# EAGLE design main board (EAGLE 9.6.2)
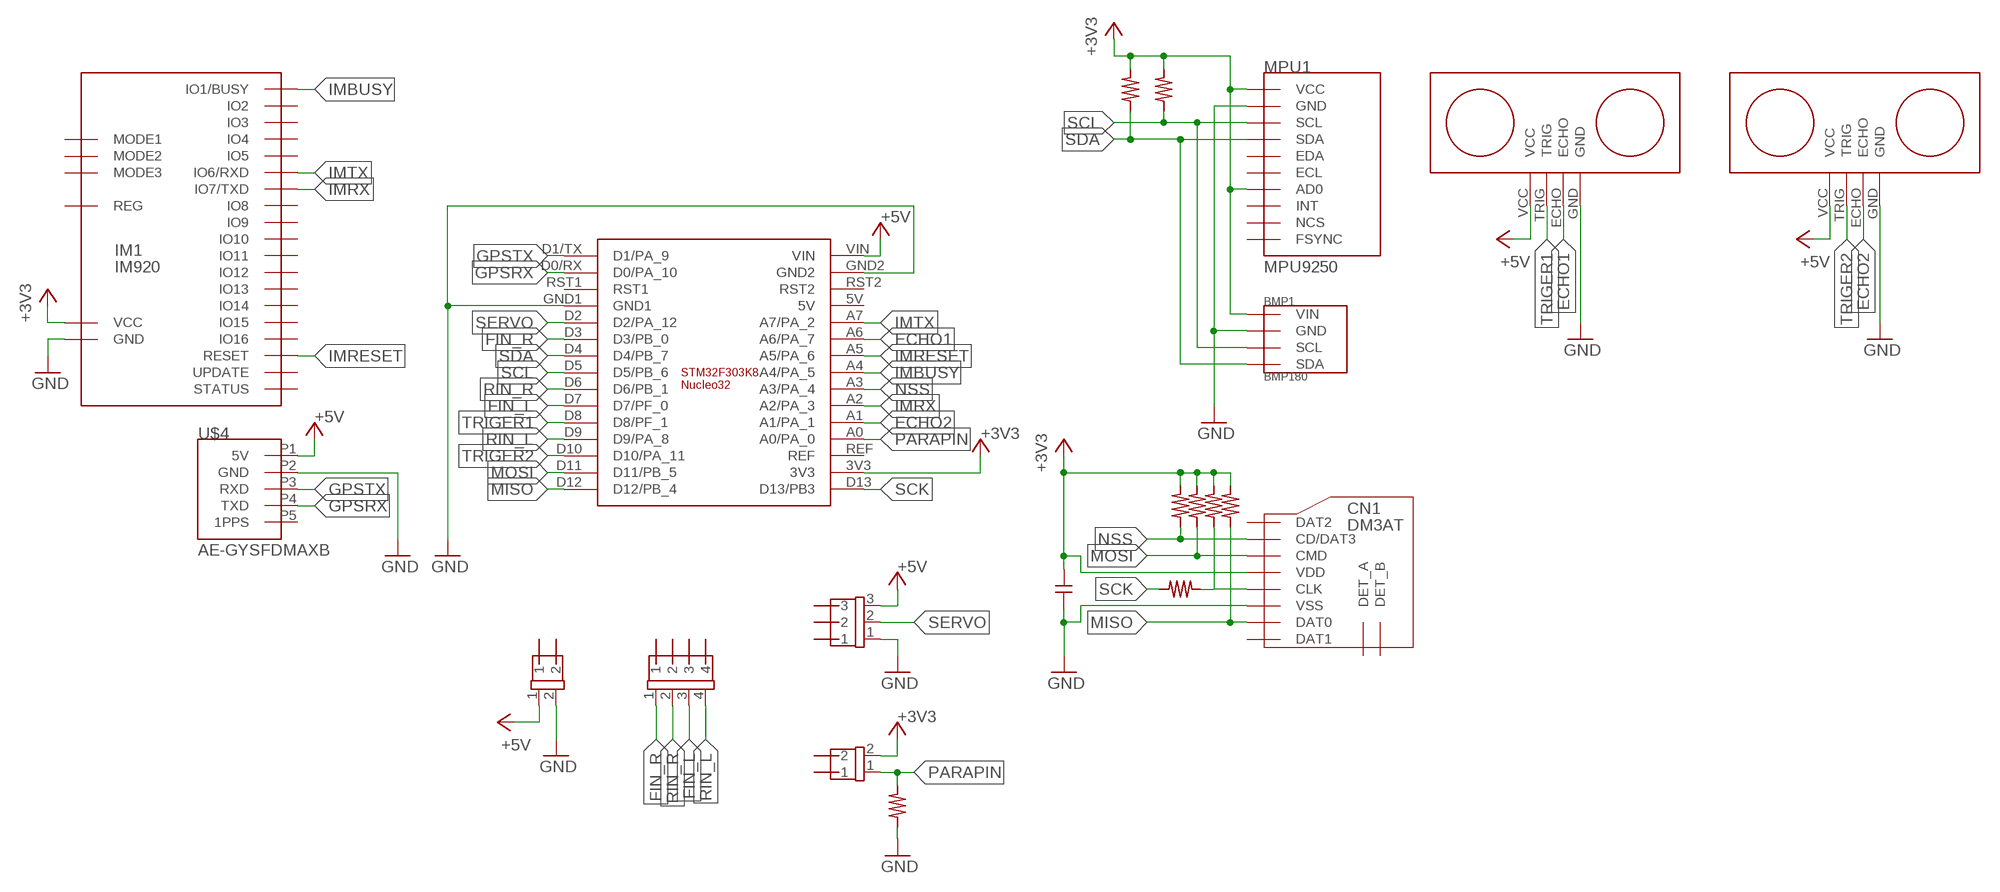
[diagram p0: schematic, sheet 1]

## Parts
BMP1  BMP180  [GY-68]
C4  CAPACITOR-CERAMICC_1  [CAPACITOR-CERAMICC_1]
CN1  DM3AT  [DM3AT]
CONN1  2PIN  [2PIN]
CONN2  2PIN  [2PIN]
CONN3  4PIN  [4PIN]
CONN4  3PIN  [3PIN]
CP1  STM32F303K8-NUCLEO32  [STM32-NUCLEO32]
EC1  ECHO  [ECHO]
EC2  ECHO  [ECHO]
IM1  IM920  [IM920]
MPU1  MPU9250  [GY-9250]
R2  RESISTER  [REGISTER]
R4  RESISTER  [REGISTER]
R5  RESISTER  [REGISTER]
R6  RESISTER  [REGISTER]
R7  RESISTER  [REGISTER]
R8  RESISTER  [REGISTER]
R9  RESISTER  [REGISTER]
R10  RESISTER  [REGISTER]
U$4  AE-GYSFDMAXB  [AE-GYSFDMAXB]

## Nets
+3V3: BMP1.P1(VIN) C4.2 CN1.VDD CONN1.2 CP1.3V3 IM1.IO23(VCC) MPU1.P1(VCC) MPU1.P7(AD0) R4.B R5.B R6.B R7.B R8.B R9.B
+5V: CONN2.1 CONN4.3 CP1.VIN EC1.VCC EC2.VCC U$4.P1(5V)
ECHO1: CP1.A6(A6/PA_7) EC1.ECHO
ECHO2: CP1.A1(A1/PA_1) EC2.ECHO
FIN_L: CONN3.3 CP1.D7(D7/PF_0)
FIN_R: CONN3.1 CP1.D3(D3/PB_0)
GND: BMP1.P2(GND) C4.1 CN1.VSS CONN2.2 CONN4.1 CP1.GND1 CP1.GND2 EC1.GND EC2.GND IM1.IO24(GND) MPU1.P2(GND) R2.A U$4.P2(GND)
GPSRX: CP1.D0/RX(D0/PA_10) U$4.P4(TXD)
GPSTX: CP1.D1/TX(D1/PA_9) U$4.P3(RXD)
IMBUSY: CP1.A4(A4/PA_5) IM1.IO1(IO1/BUSY)
IMRESET: CP1.A5(A5/PA_6) IM1.IO25(RESET)
IMRX: CP1.A2(A2/PA_3) IM1.IO7(IO7/TXD)
IMTX: CP1.A7(A7/PA_2) IM1.IO6(IO6/RXD)
MISO: CN1.DAT0 CP1.D12(D12/PB_4) R6.A
MOSI: CN1.CMD CP1.D11(D11/PB_5) R8.A
N$6: CN1.CLK R7.A R10.B
NSS: CN1.CD/DAT3 CP1.A3(A3/PA_4) R9.A
PARAPIN: CONN1.1 CP1.A0(A0/PA_0) R2.B
RIN_L: CONN3.4 CP1.D9(D9/PA_8)
RIN_R: CONN3.2 CP1.D6(D6/PB_1)
SCK: CP1.D13(D13/PB3) R10.A
SCL: BMP1.P3(SCL) CP1.D5(D5/PB_6) MPU1.P3(SCL) R4.A
SDA: BMP1.P4(SDA) CP1.D4(D4/PB_7) MPU1.P4(SDA) R5.A
SERVO: CONN4.2 CP1.D2(D2/PA_12)
TRIGER1: CP1.D8(D8/PF_1) EC1.TRIG
TRIGER2: CP1.D10(D10/PA_11) EC2.TRIG
Unconnected: CN1.DAT1 CN1.DAT2 CN1.DET_A CN1.DET_B CP1.5V CP1.REF CP1.RST1 CP1.RST2 IM1.IO2 IM1.IO3 IM1.IO4 IM1.IO5 IM1.IO8 IM1.IO9 IM1.IO10 IM1.IO11 IM1.IO12 IM1.IO13 IM1.IO14 IM1.IO15 IM1.IO16 IM1.IO17(MODE1) IM1.IO18(MODE2) IM1.IO19(MODE3) IM1.IO20(UPDATE) IM1.IO21(STATUS) IM1.IO22(REG) MPU1.P5(EDA) MPU1.P6(ECL) MPU1.P8(INT) MPU1.P9(NCS) MPU1.P10(FSYNC) U$4.P5(1PPS)

## Library data of the parts
BMP1 = BMP180:BMP180
C4 = normal capacitor:CAPACITOR-CERAMICC_1
CN1 = microSD:DM3AT
CONN1 CONN2 = 171822 connecter:2PIN
CONN3 = 171822 connecter:4PIN
CONN4 = 171822 connecter:3PIN
CP1 = STM32:STM32F303K8-NUCLEO32
EC1 EC2 = ECHO:ECHO
IM1 = IM920:IM920
MPU1 = MPU9250:MPU9250
R2 R4-R10 = normal register:RESISTER
U$4 = AE-GYSFDMAXB:AE-GYSFDMAXB

## Board
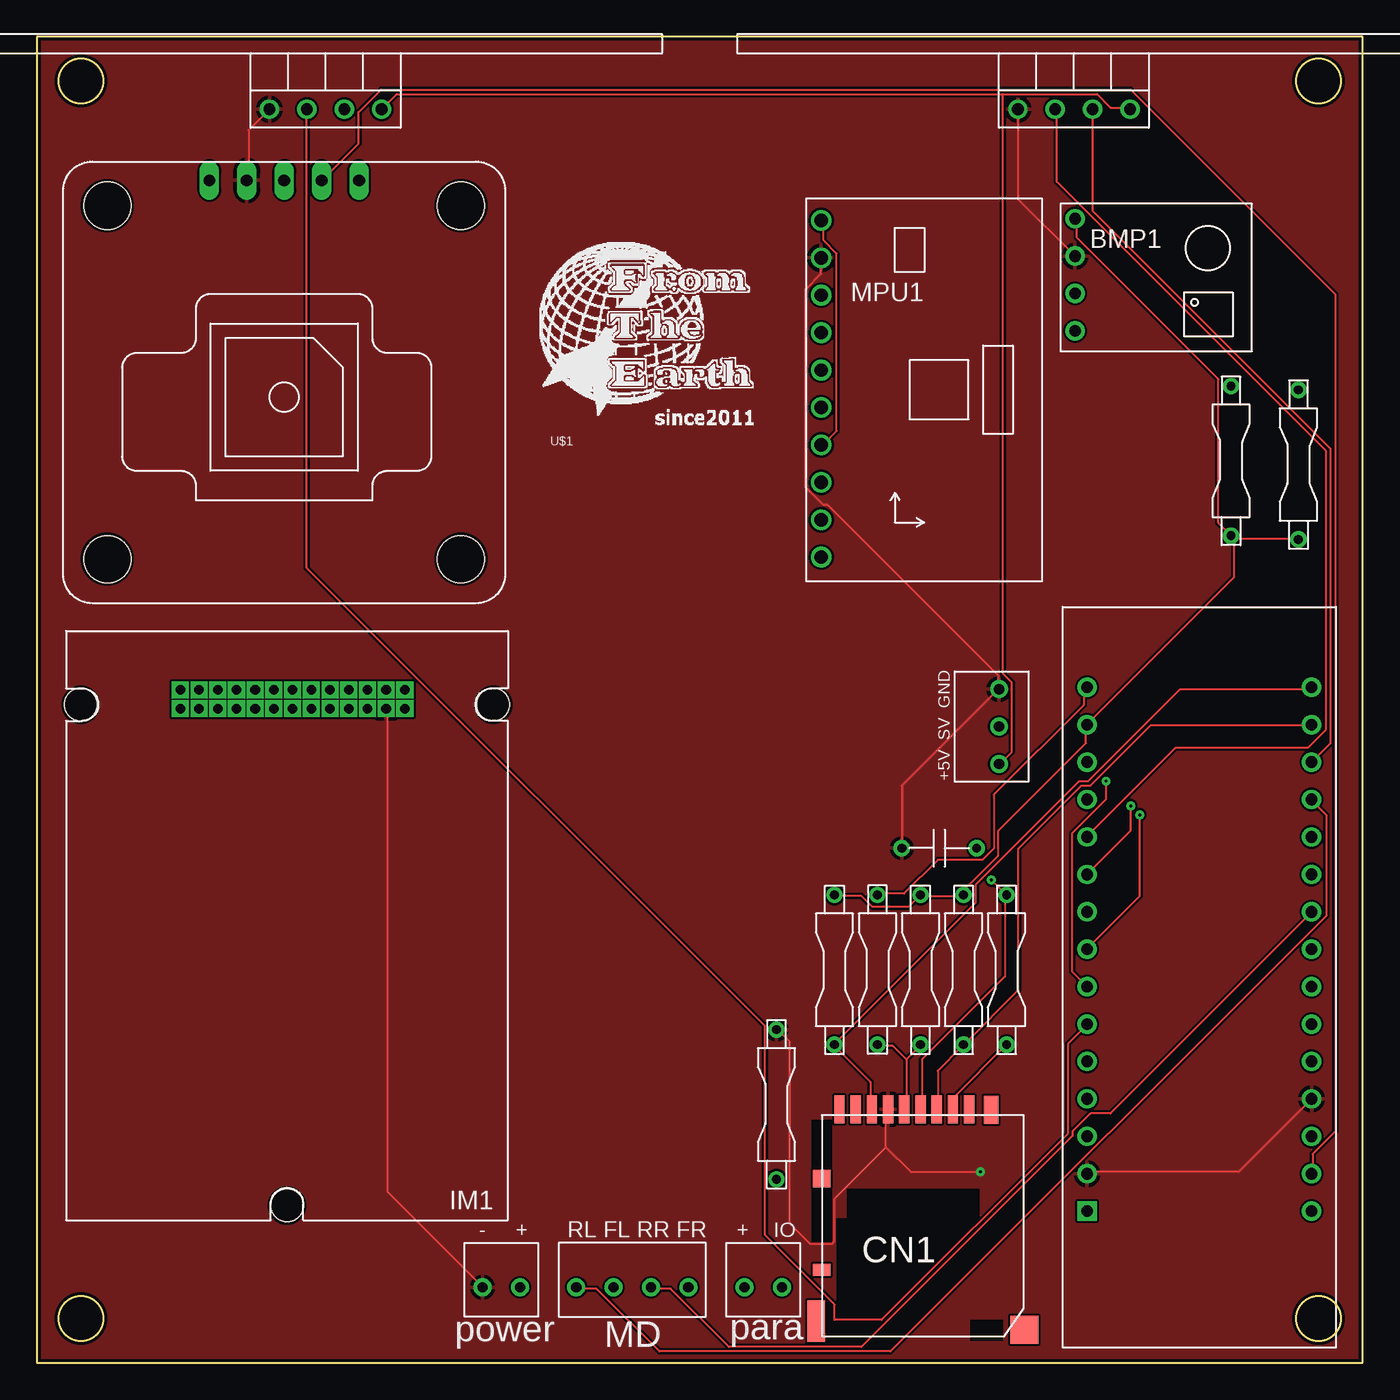
[diagram p1: board, top side]
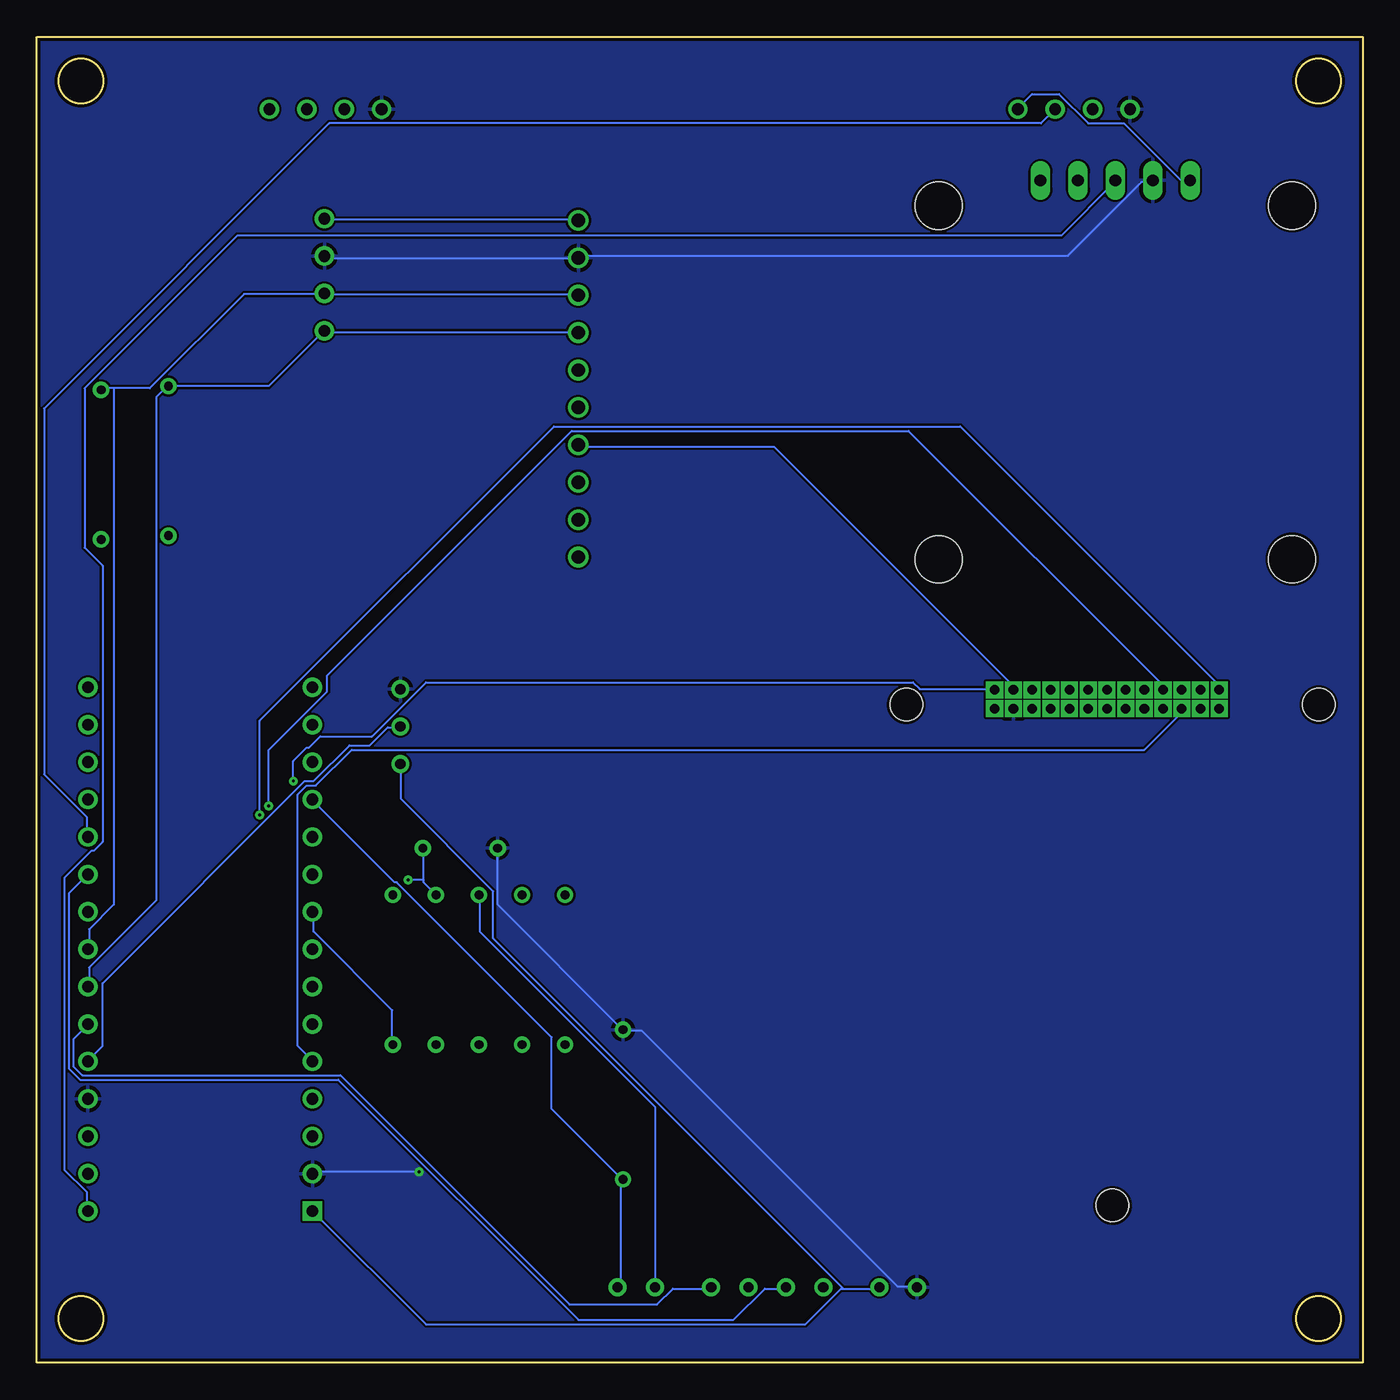
[diagram p2: board, bottom side, seen from below]

Size 90 x 90 mm. Coordinates in mm from the lower left corner, seen from the top.
Outline: 90,0 90,90 0,90 0,0 90,0
Outline: circle at 87,3 radius 1.5
Outline: circle at 3,3 radius 1.5
Outline: circle at 3,87 radius 1.5
Outline: circle at 87,87 radius 1.5
Copper layers (1*16): Top 0.035mm / dielectric 1.5mm / Bottom 0.035mm
Design rules "PCBGoGo": minimum track width 6mil, minimum drill 0.2mm, track to track 6mil, track to pad 6mil, pad to pad 6mil, via to via 6mil, smd to smd 6mil, copper to edge 0.2mm, drill to drill 6mil, minimum pad ring 10mil, minimum via ring 8mil, stop-mask expansion 4mil, vias tented up to drill 0mil, thermal gap 10mil

### Footprints (pad centres in the part's own frame; a part is rotated, then mirrored left to right if it is on the bottom)
GY-68 = drill 0.8: P1 -5,4; P2 -5,1.46; P3 -5,-1.08; P4 -5,-3.62
CAPACITOR-CERAMICC_1 = drill 0.6: 1 -2.54,0; 2 2.54,0
DM3AT = smd 0.7 x 1.9: CD/DAT3 2.2,6.4; CLK -1.1,6.4; CMD 1.1,6.4; DAT0 -3.3,6.4; DAT1 -4.4,6.4; DAT2 3.3,6.4; DET_B -5.5,6.4; VDD 0,6.4; VSS -2.2,6.4 | smd 1.2 x 0.8: DET_A -6.7,-4.5 | smd 1 x 1.9: P$9 4.8,6.381 | smd 1.2 x 1.2: P$11 -6.7,1.7 | smd 1.2 x 2.8: P$13 -7.081,-7.973 | smd 1.9 x 1.9: P$14 7.054,-8.562
2PIN = drill 0.7: 1 -1.27,0; 2 1.27,0
4PIN = drill 0.7: 1 -3.81,0; 2 -1.27,0; 3 1.27,0; 4 3.81,0
3PIN = drill 0.7: 1 -2.54,0; 2 0,0; 3 2.54,0
STM32-NUCLEO32 = drill 0.8: 3V3 8.001,-16.891; 5V 33.401,-16.891; A0 13.081,-16.891; A1 15.621,-16.891; A2 18.161,-16.891; A3 20.701,-16.891; A4 23.241,-16.891; A5 25.781,-16.891; A6 28.321,-16.891; A7 30.861,-16.891; D0/RX 38.481,-1.651; D1/TX 41.021,-1.651; D2 30.861,-1.651; D3 28.321,-1.651; D4 25.781,-1.651; D5 23.241,-1.651; D6 20.701,-1.651; D7 18.161,-1.651; D8 15.621,-1.651; D9 13.081,-1.651; D10 10.541,-1.651; D11 8.001,-1.651; D12 5.461,-1.651; D13 5.461,-16.891; GND1 33.401,-1.651; GND2 38.481,-16.891; REF 10.541,-16.891; RST1 35.941,-1.651; RST2 35.941,-16.891 | drill 0.8 square: VIN 41.021,-16.891
ECHO = drill 0.8: ECHO -1.27,0; GND -3.81,0; TRIG 1.27,0; VCC 3.81,0
IM920 = drill 0.65 square: IO1 7.24,-16; IO2 7.24,-14.73; IO3 5.97,-16; IO4 5.97,-14.73; IO5 4.7,-16; IO6 4.7,-14.73; IO7 3.43,-16; IO8 3.43,-14.73; IO9 2.16,-16; IO10 2.16,-14.73; IO11 0.89,-16; IO12 0.89,-14.73; IO13 -0.38,-16; IO14 -0.38,-14.73; IO15 -1.65,-16; IO16 -1.65,-14.73; IO17 -2.92,-16; IO18 -2.92,-14.73; IO19 -4.19,-16; IO20 -4.19,-14.73; IO21 -5.46,-16; IO22 -5.46,-14.73; IO23 -6.73,-16; IO24 -6.73,-14.73; IO25 -8,-16; IO26 -8,-14.73 | hole 2.2: -14,-15; 14,-15; 0,19
GY-9250 = drill 0.9: P1 -7,11.5; P2 -7,8.96; P3 -7,6.42; P4 -7,3.88; P5 -7,1.34; P6 -7,-1.2; P7 -7,-3.74; P8 -7,-6.28; P9 -7,-8.82; P10 -7,-11.36
REGISTER = drill 0.6: A -5.08,0; B 5.08,0
AE-GYSFDMAXB = drill 0.8 long: P1 13.716,5.08; P2 13.716,2.54; P3 13.716,0; P4 13.716,-2.54; P5 13.716,-5.08 | hole 3.2: -12,12; 12,12; 12,-12; -12,-12

### Placement (x,y rotation side)
BMP1  75.48,73.66 0 top
C4  61.26,34.92 0 top
CN1  59.99,10.79 0 top
CONN1  49.31,5.12 180 top
CONN2  31.53,5.12 180 top
CONN3  40.42,5.12 180 top
CONN4  65.32,43.18 270 top
CP1  88.18,51.31 270 top
EC1  19.6,85.09 0 top
EC2  70.4,85.09 0 top
IM1  16.98,29.67 180 top
MPU1  60.24,66.04 0 top
R2  50.21,17.53 270 top
R4  85.64,60.96 270 top
R5  81.07,61.21 270 top
R6  54.14,26.67 90 top
R7  59.99,26.67 90 top
R8  62.91,26.67 90 top
R9  65.83,26.67 90 top
R10  57.06,26.67 270 top
U$1  [LOGO]  33.57,62.23 0 top
U$4  16.79,66.54 90 top

### Tracks (layer width: path | path; a pad name or v marks a point on that pad's centre or on a via)
+3V3  (via drill 0.2)
  Top 0.152: MPU1.P1 53.38,77.42 53.38,76.2 54.3,75.29 54.3,63.25 53.38,62.33 MPU1.P7 | CN1.VDD 60.09,17.22 60.09,20.57 65.73,26.21 65.73,31.7 R9.B v64.81,32.77 | 81.27,55.93 85.54,55.93 R4.B | R6.B 54.14,31.7 55.97,31.7 56.73,30.94 59.17,30.94 R7.B 60.09,31.7 62.83,31.7 R8.B 62.98,31.85 62.98,32.16 65.27,34.44 65.27,36.12 71.21,42.06 71.21,43.28 CP1.3V3 71.36,43.43 81.27,53.34 81.27,55.93 | BMP1.P1 70.6,77.57 70.6,76.35 80.2,66.75 80.2,57 R5.B 81.27,55.93
  Bottom 0.152: BMP1.P1 70.45,77.57 53.38,77.57 MPU1.P1 | IM1.IO23 23.82,45.72 23.82,46.02 39.97,62.18 53.23,62.18 MPU1.P7 | 63.75,32.77 63.75,32.61 62.98,31.85 R8.B | 63.75,32.77 63.75,34.9 C4.2 | CONN1.2 48.05,5.18 48.05,17.37 59.94,29.26 59.94,31.7 R7.B | 63.75,32.77 v64.81,32.77
+5V
  Top 0.152: 65.57,86.11 24.43,86.11 EC1.VCC | 65.57,86.11 71.97,86.11 72.89,85.19 74.11,85.19 EC2.VCC | 65.57,86.11 65.57,46.79 66.18,46.18 66.18,41.45 65.42,40.69 CONN4.3
  Bottom 0.152: U$4.P1 11.78,80.31 12.39,80.31 16.2,84.12 18.64,84.12 20.62,86.11 22.45,86.11 23.36,85.19 EC1.VCC | 35.25,5.03 35.4,5.03 37.84,2.59 63.59,2.59 CP1.VIN | 35.25,5.03 32.81,5.03 CONN2.1 | 35.25,5.03 59.02,28.8 59.02,32 65.27,38.25 65.27,40.54 CONN4.3
ECHO1
  Top 0.152: EC1.ECHO 18.33,53.95 49.42,22.86 49.42,8.69 54.14,3.96 54.14,2.9 57.34,2.9 69.99,15.54 69.99,21.64 71.21,22.86 CP1.A6
ECHO2
  Top 0.152: EC2.ECHO 69.23,85.04 69.23,80.16 87.52,61.87 87.52,42.98 86.3,41.76 77.31,41.76 71.36,35.81 CP1.A1
FIN_L
  Bottom 0.152: CP1.D7 87.82,31.85 87.82,19.96 87.06,19.2 69.54,19.2 53.23,2.9 42.71,2.9 40.58,5.03 39.21,5.03 CONN3.3
FIN_R
  Bottom 0.152: CONN3.1 44.24,5.03 46.83,5.03 47.9,3.96 53.84,3.96 69.38,19.51 86.91,19.51 87.52,20.12 87.52,21.95 86.6,22.86 CP1.D3
GND  (via drill 0.2)
  Top 0.152: EC1.GND 14.37,83.67 14.37,80.31 U$4.P2 | EC2.GND 66.64,85.04 66.64,78.94 70.45,75.13 BMP1.P2 | IM1.IO24 23.82,44.35 23.82,11.58 30.22,5.18 CONN2.2 | CP1.GND1 81.58,12.95 71.36,12.95 CP1.GND2 | C4.1 58.72,39.17 65.27,45.72 | 57.65,14.63 57.65,17.07 CN1.VSS | 57.65,14.63 54.14,11.12 54.14,8.23 53.99,8.08 52.47,8.08 51.1,9.45 51.1,21.79 50.33,22.55 R2.A | v64.05,12.95 59.33,12.95 57.65,14.63 | 65.27,45.72 65.27,46.63 53.69,58.22 53.38,58.22 52.16,59.44 52.16,72.85 53.23,73.91 53.23,74.98 MPU1.P2 | 65.27,45.72 CONN4.1
  Bottom 0.152: BMP1.P2 70.45,74.98 53.38,74.98 MPU1.P2 53.23,75.13 20.01,75.13 14.98,80.16 14.37,80.16 U$4.P2 | C4.1 58.72,31.09 50.33,22.71 R2.A 50.18,22.55 48.96,22.55 31.59,5.18 30.37,5.18 CONN2.2 | v64.05,12.95 71.21,12.95 CP1.GND2
  pour Top: -5,100 -5,-10 95,-10 95,100
  pour Bottom: -5,100 -5,-10 95,-10 95,100
GPSRX
  Top 0.152: CP1.D0/RX 86.6,12.95 86.6,14.17 88.13,15.7 88.13,72.54 74.26,86.41 23.36,86.41 21.84,84.89 21.84,82.75 19.4,80.31 U$4.P4
GPSTX
  Bottom 0.152: CP1.D1/TX 86.6,10.36 86.6,11.58 88.13,13.11 88.13,32.92 86.3,34.75 86.15,34.75 85.54,35.36 85.54,54.1 86.76,55.32 86.76,66.14 76.39,76.5 20.46,76.5 16.81,80.16 U$4.P3
IMBUSY  (via drill 0.2)
  Top 0.152: v74.87,37.19 74.87,31.7 71.36,28.19 CP1.A4
  Bottom 0.152: v74.87,37.19 74.87,43.59 54.91,63.55 27.32,63.55 9.8,46.02 9.8,45.72 IM1.IO1
IMRESET  (via drill 0.2)
  Top 0.152: v72.58,39.47 72.58,38.25 70.3,35.97 70.3,26.52 CP1.A5
  Bottom 0.152: v72.58,39.47 72.58,40.84 71.67,41.76 71.52,41.76 70.76,42.52 67.25,42.52 63.59,46.18 30.52,46.18 30.06,45.72 25.04,45.72 IM1.IO25
IMRX  (via drill 0.2)
  Top 0.152: v74.26,37.8 74.26,36.12 CP1.A2
  Bottom 0.152: v74.26,37.8 74.26,41.6 70.3,45.57 70.3,46.63 53.69,63.25 30.83,63.25 13.61,46.02 13.61,45.72 IM1.IO7
IMTX
  Bottom 0.152: IM1.IO6 12.39,44.35 12.39,44.04 14.82,41.6 68.62,41.6 71.06,39.17 71.67,39.17 72.28,38.56 72.28,21.49 71.36,20.57 CP1.A7
MISO
  Top 0.152: CN1.DAT0 56.58,17.22 56.58,19.05 54.14,21.49 R6.A 54.14,21.64 63.75,31.24 63.75,32.46 70.76,39.47 71.36,39.47 77.61,45.72 86.45,45.72 CP1.D12
MOSI
  Top 0.152: CN1.CMD 61.15,17.22 61.15,19.81 62.83,21.49 R8.A 62.98,21.64 66.64,25.3 66.64,34.9 70.91,39.17 71.52,39.17 75.63,43.28 86.45,43.28 CP1.D11
N$6
  Top 0.152: 59.02,20.57 59.02,17.22 CN1.CLK | 59.02,20.57 59.94,21.49 R7.A | 59.02,20.57 58.11,21.49 57.19,21.49 R10.B
NSS
  Top 0.152: R9.A 62.22,17.98 62.22,17.22 CN1.CD/DAT3
  Bottom 0.152: CP1.A3 71.21,30.48 71.21,29.26 65.88,23.93 65.88,21.64 R9.A
PARAPIN
  Bottom 0.152: CONN1.1 50.49,5.18 50.33,5.33 50.33,12.34 R2.B 50.33,12.5 55.06,17.22 55.06,22.1 65.57,32.61 65.73,32.61 71.21,38.1 CP1.A0
RIN_L
  Top 0.152: CONN3.4 36.62,5.03 37.99,5.03 42.26,0.76 57.95,0.76 87.52,30.33 87.52,37.19 86.6,38.1 CP1.D9
RIN_R
  Top 0.152: CONN3.2 41.8,5.03 43.02,5.03 46.98,1.07 55.97,1.07 70.3,15.39 70.3,15.7 71.52,16.92 72.89,16.92 86.45,30.48 CP1.D6
SCK
  Top 0.152: R10.A 57.19,31.85 58.87,31.85 61.15,34.14 64.2,34.14 64.96,34.9 64.96,38.56 71.06,44.65 71.06,45.57 71.21,45.72 CP1.D13
SCL
  Bottom 0.152: 84.78,66.14 82.34,66.14 75.94,72.54 70.6,72.54 BMP1.P3 70.45,72.54 53.38,72.54 MPU1.P3 | 84.78,66.14 85.54,66.14 R4.A | 84.78,66.14 84.78,31.09 86.45,29.41 86.45,28.19 CP1.D5
SDA
  Bottom 0.152: CP1.D4 86.45,25.6 86.45,26.82 81.88,31.39 81.88,65.53 81.12,66.29 R5.A 74.26,66.29 70.6,69.95 BMP1.P4 70.45,69.95 53.38,69.95 MPU1.P4
SERVO
  Bottom 0.152: CONN4.2 65.42,43.13 66.18,43.13 67.4,41.91 68.77,41.91 71.21,39.47 71.82,39.47 85.54,25.76 85.54,21.49 86.45,20.57 CP1.D2
TRIGER1
  Bottom 0.152: EC1.TRIG 21.84,84.12 70.15,84.12 89.5,64.77 89.5,39.93 86.6,37.03 86.6,35.81 CP1.D8
TRIGER2
  Top 0.152: EC2.TRIG 71.67,78.18 87.82,62.03 87.82,42.06 CP1.D10

### Text on the board
tPlace: +5V SV GND | - | + | RL FL RR FR | + | IO | para | power | MD